# Altium schematic sheet PID _v2.SchDoc
size A4
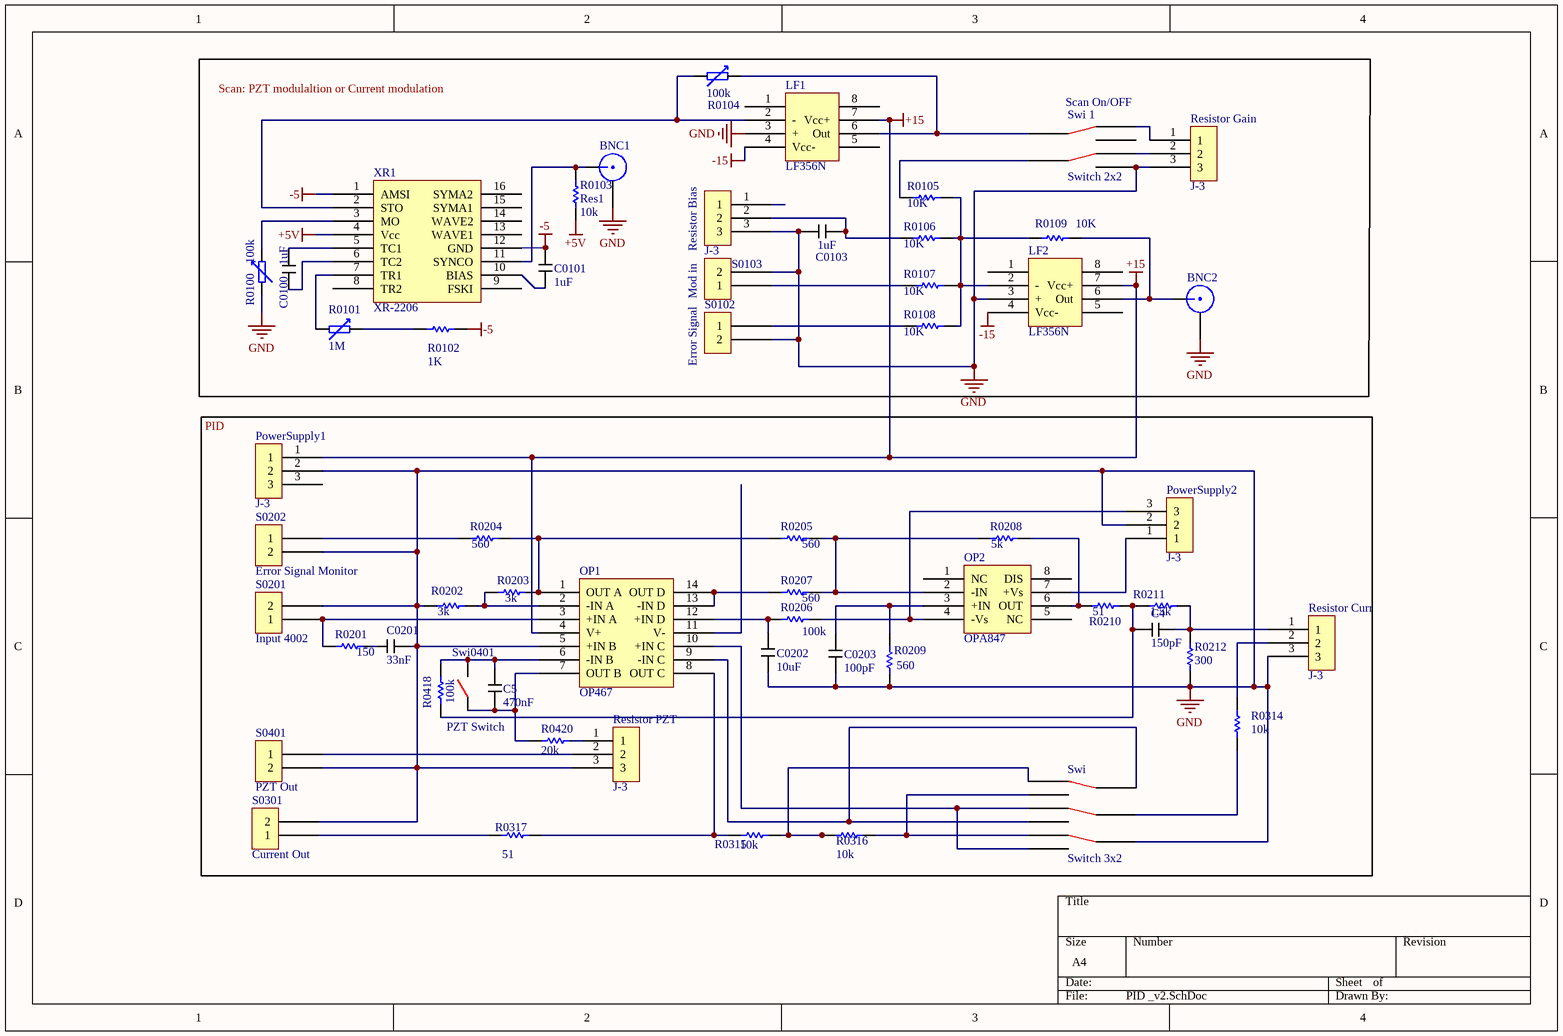
[diagram p0: PID _v2.SchDoc]

## Parts
BNC1  BNC  [BNC-KE]  (value not drawn)
BNC2  BNC  [BNC-KE]  (value not drawn)
C4  150pF  [Capacitor]
C5  470nF  [Capacitor]
C0100  1uF  [Capacitor]
C0101  1uF  [Capacitor]
C0103  1uF  [Capacitor]
C0201  33nF  [Capacitor]
C0202  10uF  [Capacitor]
C0203  100pF  [Capacitor]
LF1  LF356N  [DIP8]
LF2  LF356N  [DIP8]
OP1  OP467  [DIP14]
OP2  OPA847  [DIP8]
PowerSupply1  J-3  [J3]
PowerSupply2  J-3  [J3]
R0100  100k  [J3]
R0101  1M  [J3]
R0102  value 1K  [AXIAL-0.3]  (hidden comment: Res1)
R0103  Res1  value 10k  [AXIAL-0.3]
R0104  100k  [Res Adj 2]
R0105  value 10K  [AXIAL-0.3]  (hidden comment: Res1)
R0106  value 10K  [AXIAL-0.3]  (hidden comment: Res1)
R0107  value 10K  [AXIAL-0.3]  (hidden comment: Res1)
R0108  value 10K  [AXIAL-0.3]  (hidden comment: Res1)
R0109  value 10K  [AXIAL-0.3]  (hidden comment: Res1)
R0201  value 150  [AXIAL-0.3]  (hidden comment: Res1)
R0202  value 3k  [AXIAL-0.3]  (hidden comment: Res1)
R0203  value 3k  [AXIAL-0.3]  (hidden comment: Res1)
R0204  value 560  [AXIAL-0.3]  (hidden comment: Res1)
R0205  value 560  [AXIAL-0.3]  (hidden comment: Res1)
R0206  value 100k  [AXIAL-0.3]  (hidden comment: Res1)
R0207  value 560  [AXIAL-0.3]  (hidden comment: Res1)
R0208  value 5k  [AXIAL-0.3]  (hidden comment: Res1)
R0209  value 560  [AXIAL-0.3]  (hidden comment: Res1)
R0210  value 51  [AXIAL-0.3]  (hidden comment: Res1)
R0211  value 1.5k  [AXIAL-0.3]  (hidden comment: Res1)
R0212  value 300  [AXIAL-0.3]  (hidden comment: Res1)
R0314  value 10k  [AXIAL-0.3]  (hidden comment: Res1)
R0315  value 10k  [AXIAL-0.3]  (hidden comment: Res1)
R0316  value 10k  [AXIAL-0.3]  (hidden comment: Res1)
R0317  value 51  [AXIAL-0.3]  (hidden comment: Res1)
R0418  value 100k  [AXIAL-0.3]  (hidden comment: Res1)
R0420  value 20k  [AXIAL-0.3]  (hidden comment: Res1)
Resistor_Bias  J-3  [J3]
Resistor_Curr  J-3  [J3]
Resistor_Gain  J-3  [J3]
Resistor_PZT  J-3  [J3]
S0102  Error Signal  [SMA-S]
S0103  Mod in  [SMA-S]
S0201  Input 4002  [SMA-S]
S0202  Error Signal Monitor  [SMA-S]
S0301  Current Out  [SMA-S]
S0401  PZT Out  [SMA-S]
Swi  Switch 3x2  [Swi 3x2]
Swi0401  PZT Switch  [J2]
Swi_1  Switch 2x2  [Swi 2x2]
XR1  XR-2206  [DIP16]

## Blocks framed on the sheet
PID: C4 C5 C0201 C0202 C0203 OP1 OP2 PowerSupply1 PowerSupply2 R0201 R0202 R0203 R0204 R0205 R0206 R0207 R0208 R0209 R0210 R0211 R0212 R0314 R0315 R0316 R0317 R0418 R0420 Resistor_Curr Resistor_PZT S0201 S0202 S0301 S0401 Swi Swi0401

## Nets
+5V: R0103.1 XR1.4(Vcc)
+15: LF1.7(Vcc+) LF2.7(Vcc+) OP1.4(V+) PowerSupply1.1
-5: C0101.2 R0102.2 XR1.1(AMSI) XR1.12(GND)
-15: LF1.4(Vcc-) LF2.4(Vcc-)
GND: BNC1.2 BNC2.2 C0103.1 C0201.2 C0202.1 C0203.2 LF1.3(+) LF2.3(+) OP1.5(+IN_B) PowerSupply1.2 PowerSupply2.2 R0100.1 R0202.2 R0209.1 R0212.2 Resistor_Bias.3 Resistor_Curr.3 Resistor_Gain.3 Resistor_PZT.3 S0102.2 S0103.2 S0201.2 S0202.2 S0301.2 S0401.2 Swi.3 Swi_1.6
NetBNC1_1: BNC1.1 R0103.2 XR1.11(SYNCO)
NetBNC2_1: BNC2.1 LF2.6(Out) R0109.2
NetC4_1: C4.1 R0211.2 R0212.1 Resistor_Curr.1
NetC4_2: C4.2 R0210.2 R0211.1 R0418.1
NetC5_1: C5.1 OP1.6(-IN_B) R0418.2 Swi0401.2
NetC5_2: C5.2 OP1.7(OUT_B) R0420.2 Swi0401.1
NetC0100_1: C0100.1 XR1.5(TC1)
NetC0100_2: C0100.2 XR1.6(TC2)
NetC0101_1: C0101.1 XR1.10(BIAS)
NetC0103_2: C0103.2 R0106.1 Resistor_Bias.2
NetC0201_1: C0201.1 R0201.2
NetC0202_2: C0202.2 OP1.12(+IN_D) R0206.2
NetC0203_1: C0203.1 OP2.3(+IN) R0209.2
NetLF1_2: LF1.2(-) R0104.1 XR1.2(STO)
NetLF1_6: LF1.6(Out) R0104.2 Swi_1.1
NetLF2_2: LF2.2(-) R0105.2 R0106.2 R0107.2 R0108.2 R0109.1
NetOP1_1: OP1.1(OUT_A) R0203.2 R0204.2 R0205.1
NetOP1_2: OP1.2(-IN_A) R0202.1 R0203.1
NetOP1_3: OP1.3(+IN_A) R0201.1 S0201.1
NetOP1_8: OP1.8(OUT_C) R0315.2 R0317.2
NetOP1_9: OP1.9(-IN_C) Swi.1 Swi.7
NetOP1_10: OP1.10(+IN_C) Swi.6 Swi.9
NetOP1_13: OP1.13(-IN_D) OP1.14(OUT_D) R0207.1
NetOP2_2: OP2.2(-IN) R0205.2 R0207.2 R0208.1
NetOP2_4: OP2.4(-Vs) PowerSupply2.3 R0206.1
NetOP2_6: OP2.6(OUT) R0208.2 R0210.1
NetOP2_7: OP2.7(+Vs) PowerSupply2.1
NetR0100_2: R0100.2 XR1.3(MO)
NetR0101_1: R0101.1 XR1.7(TR1)
NetR0101_2: R0101.2 R0102.1
NetR0105_1: R0105.1 Swi_1.2
NetR0107_1: R0107.1 S0103.1
NetR0108_1: R0108.1 S0102.1
NetR0204_1: R0204.1 S0202.1
NetR0314_1: R0314.1 Swi.2
NetR0314_2: R0314.2 Resistor_Curr.2
NetR0315_1: R0315.1 R0316.2 Swi.4
NetR0316_1: R0316.1 Swi.5 Swi.8
NetR0317_1: R0317.1 S0301.1
NetR0420_1: R0420.1 Resistor_PZT.1
NetResistor_Gain_1: Resistor_Gain.1 Swi_1.3
NetResistor_Gain_2: Resistor_Gain.2 Swi_1.4
NetResistor_PZT_2: Resistor_PZT.2 S0401.1

Not connected (* = marked no-connect by the designer): LF1 1(Offset_Null) 5(Offset_Null2) 8(N.C.); LF2 1(Offset_Null) 5(Offset_Null2) 8(N.C.); OP1 11(V-); OP2 1(NC) 5(NC) 8(DIS); PowerSupply1 3; Resistor_Bias 1; Swi_1 5; XR1 8(TR2) 9(FSKI) 13(WAVE1) 14(WAVE2) 15(SYMA1) 16(SYMA2)

## Notes on the sheet
- Scan: PZT modulaltion or Current modulation
- (near Swi_1) Scan On/OFF

## Library data of the parts
C4 C5 C0100 C0101 C0103 C0201 C0202 C0203 = Cap
R0100 R0101 R0104 = Res Adj
R0102 R0103 R0105 R0106 R0107 R0108 R0109 R0201 R0202 R0203 R0204 R0205 R0206 R0207 R0208 R0209 R0210 R0211 R0212 R0314 R0315 R0316 R0317 R0418 R0420 = Res1: Resistor; Published: 8-Jun-2000; LatestRevisionDate: 17-Jul-2002; LatestRevisionNote: Re-released for DXP Platform.; PackageReference: AXIAL-0.3; Publisher: Altium Limited; PackageDescription: Axial Device, Thru-Hole; 2 Leads; 0.3 in Pin Spacing
S0102 S0103 S0201 S0202 S0301 S0401 = SMA-S
Swi0401 = Switch 1x1